# Altium schematic sheet [N] NAME.SchDoc
size 292 x 193 mm

## Notes on the sheet
- Title
- Size:
- Date:
- A4
- Number:
- Time:
- Revision:
- Sheet
- of
- File: